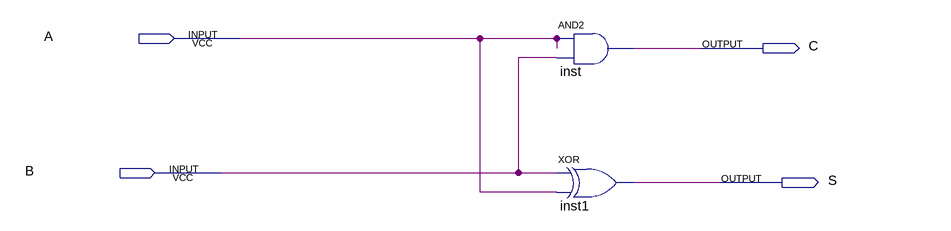
[diagram p0: schematic sheet]
// Quartus schematic HalfAdder.bdf as structural Verilog: 2 symbols, 4 pins
module HalfAdder (
  input  A,
  input  B,
  output C,
  output S
);

  and inst (C, A, B);
  xor inst1 (S, B, A);
endmodule
